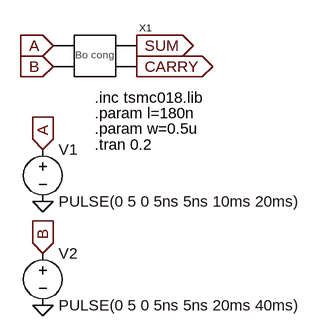
[diagram p0: schematic bocongsim.asc]
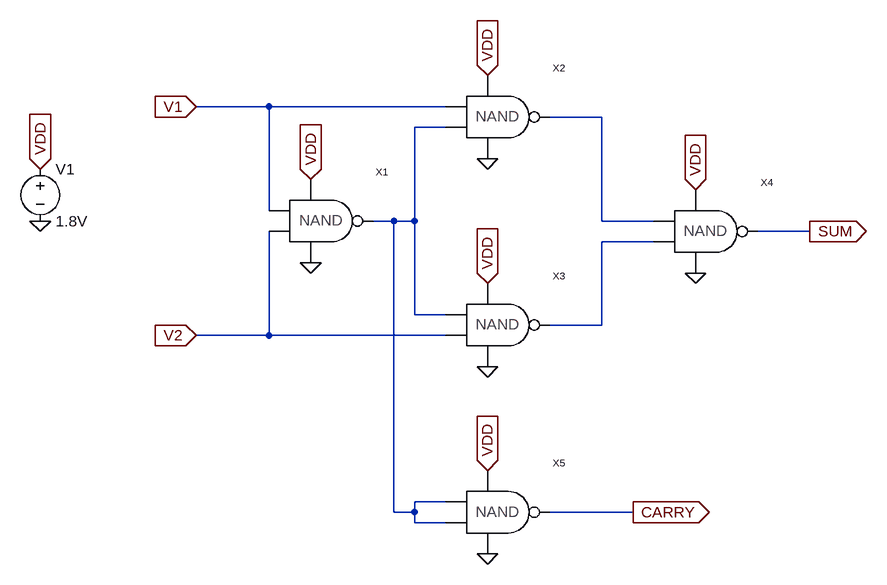
[diagram p1: sub-circuit bocong.asc]
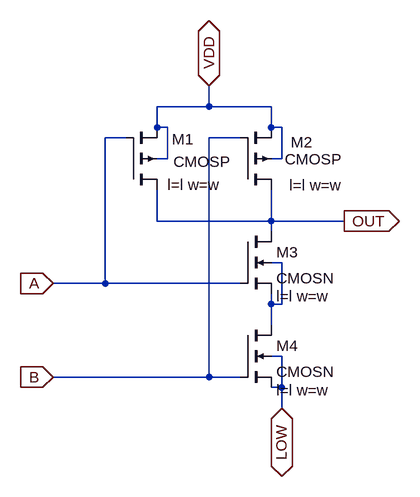
[diagram p2: sub-circuit nand.asc]
bocongsim.asc, the LTspice schematic file:
Version 4
SHEET 1 880 680
FLAG 256 112 SUM
IOPIN 256 112 Out
FLAG 256 144 CARRY
IOPIN 256 144 Out
FLAG 128 112 A
IOPIN 128 112 In
FLAG 128 144 B
IOPIN 128 144 In
FLAG 112 272 A
IOPIN 112 272 In
FLAG 112 432 B
IOPIN 112 432 In
FLAG 112 352 0
FLAG 112 512 0
SYMBOL bocong 288 304 R0
SYMATTR InstName X1
SYMBOL voltage 112 256 R0
WINDOW 123 0 0 Left 0
WINDOW 39 0 0 Left 0
SYMATTR InstName V1
SYMATTR Value PULSE(0 5 0 5ns 5ns 10ms 20ms)
SYMBOL voltage 112 416 R0
WINDOW 123 0 0 Left 0
WINDOW 39 0 0 Left 0
SYMATTR InstName V2
SYMATTR Value PULSE(0 5 0 5ns 5ns 20ms 40ms)
TEXT 192 192 Left 2 !.inc tsmc018.lib
TEXT 192 216 Left 2 !.param l=180n
TEXT 192 240 Left 2 !.param w=0.5u
TEXT 192 264 Left 2 !.tran 0.2

bocong.asc, the sub-circuit schematic file:
Version 4
SHEET 1 1080 692
WIRE 80 -16 -32 -16
WIRE 352 -16 80 -16
WIRE 592 0 512 0
WIRE 352 16 304 16
WIRE 80 144 80 -16
WIRE 272 160 240 160
WIRE 304 160 304 16
WIRE 304 160 272 160
WIRE 592 160 592 0
WIRE 672 160 592 160
WIRE 912 176 832 176
WIRE 672 192 592 192
WIRE 304 304 304 160
WIRE 352 304 304 304
WIRE 592 320 592 192
WIRE 592 320 512 320
WIRE 80 336 80 176
WIRE 80 336 -32 336
WIRE 352 336 80 336
WIRE 352 592 304 592
WIRE 272 608 272 160
WIRE 304 608 304 592
WIRE 304 608 272 608
WIRE 640 608 512 608
WIRE 304 624 304 608
WIRE 352 624 304 624
FLAG 416 384 0
FLAG 144 224 0
FLAG 736 240 0
FLAG 416 672 0
FLAG 416 64 0
FLAG 640 608 CARRY
IOPIN 640 608 Out
FLAG 912 176 SUM
IOPIN 912 176 Out
FLAG -32 -16 V1
IOPIN -32 -16 In
FLAG -32 336 V2
IOPIN -32 336 In
FLAG 416 -64 VDD
IOPIN 416 -64 In
FLAG 144 96 VDD
IOPIN 144 96 In
FLAG 416 256 VDD
IOPIN 416 256 In
FLAG 416 544 VDD
IOPIN 416 544 In
FLAG 736 112 VDD
IOPIN 736 112 In
FLAG -272 160 0
FLAG -272 80 VDD
IOPIN -272 80 In
SYMBOL NAND 160 256 R0
SYMATTR InstName X1
SYMBOL NAND 432 96 R0
SYMATTR InstName X2
SYMBOL NAND 432 416 R0
SYMATTR InstName X3
SYMBOL NAND 752 272 R0
SYMATTR InstName X4
SYMBOL NAND 432 704 R0
SYMATTR InstName X5
SYMBOL voltage -272 64 R0
WINDOW 123 0 0 Left 0
WINDOW 39 0 0 Left 0
SYMATTR InstName V1
SYMATTR Value 1.8V

nand.asc, the sub-circuit schematic file:
Version 4
SHEET 1 1024 680
WIRE 224 16 224 -16
WIRE 224 16 144 16
WIRE 320 16 224 16
WIRE 144 48 144 16
WIRE 160 48 144 48
WIRE 320 48 320 16
WIRE 336 48 320 48
WIRE 96 64 64 64
WIRE 272 64 224 64
WIRE 160 96 160 48
WIRE 160 96 144 96
WIRE 336 96 336 48
WIRE 336 96 320 96
WIRE 144 192 144 144
WIRE 320 192 320 144
WIRE 320 192 144 192
WIRE 432 192 320 192
WIRE 320 208 320 192
WIRE 336 256 320 256
WIRE 64 288 64 64
WIRE 64 288 -16 288
WIRE 272 288 64 288
WIRE 320 320 320 304
WIRE 336 320 336 256
WIRE 336 320 320 320
WIRE 320 352 320 320
WIRE 336 400 320 400
WIRE 224 432 224 64
WIRE 224 432 -16 432
WIRE 272 432 224 432
WIRE 336 448 336 400
WIRE 336 448 320 448
WIRE 336 480 336 448
FLAG 224 -16 VDD
IOPIN 224 -16 BiDir
FLAG 336 480 LOW
IOPIN 336 480 BiDir
FLAG 432 192 OUT
IOPIN 432 192 Out
FLAG -16 288 A
IOPIN -16 288 In
FLAG -16 432 B
IOPIN -16 432 In
SYMBOL nmos4 272 208 R0
WINDOW 123 56 100 Left 2
SYMATTR Value2 l=l w=w
SYMATTR InstName M3
SYMATTR Value CMOSN
SYMBOL nmos4 272 352 R0
WINDOW 123 56 100 Left 2
SYMATTR Value2 l=l w=w
SYMATTR InstName M4
SYMATTR Value CMOSN
SYMBOL pmos4 96 144 M180
WINDOW 123 64 8 Left 2
WINDOW 0 71 78 Left 2
WINDOW 3 73 43 Left 2
SYMATTR Value2 l=l w=w
SYMATTR InstName M1
SYMATTR Value CMOSP
SYMBOL pmos4 272 144 M180
WINDOW 123 76 7 Left 2
WINDOW 0 78 73 Left 2
WINDOW 3 69 47 Left 2
SYMATTR Value2 l=l w=w
SYMATTR InstName M2
SYMATTR Value CMOSP

The netlist it stands for:
* bocongsim.asc
XX1 A B SUM CARRY bocong
V1 A 0 PULSE(0 5 0 5ns 5ns 10ms 20ms)
V2 B 0 PULSE(0 5 0 5ns 5ns 20ms 40ms)

* block symbol definitions
.subckt bocong V1 V2 SUM CARRY
XX1 VDD 0 V1 V2 N002 nand
XX2 VDD 0 V1 N002 N001 nand
XX3 VDD 0 N002 V2 N003 nand
XX4 VDD 0 N001 N003 SUM nand
XX5 VDD 0 N002 N002 CARRY nand
V1 VDD 0 1.8V
.ends bocong

.subckt nand VDD LOW A B OUT
M3 OUT A N001 N001 CMOSN l=l w=w
M4 N001 B LOW LOW CMOSN l=l w=w
M1 OUT A VDD VDD CMOSP l=l w=w
M2 OUT B VDD VDD CMOSP l=l w=w
.ends nand

.model NMOS NMOS
.model PMOS PMOS
.lib standard.mos
.inc tsmc018.lib
.param l=180n
.param w=0.5u
.tran 0.2
.backanno
.end

* Results of the author's LTspice run, read from the files saved beside the schematic
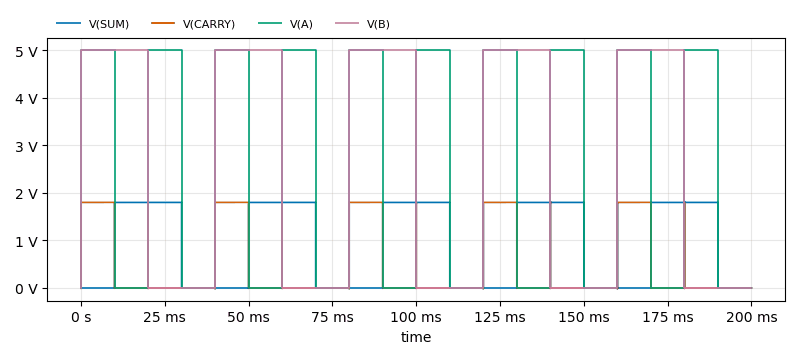
[diagram p3: Transient Analysis of bocongsim.asc, plotted from the saved traces]
* Transient Analysis, 1 run:
*   V(SUM): min -17.54 mV, max 1.819 V, average 900 mV, rms 1.273 V, last 0 V
*   V(CARRY): min -14.02 mV, max 1.807 V, average 450 mV, rms 900 mV, last 0 V
*   V(A): min 0 V, max 5 V, average 2.5 V, rms 3.536 V, last 0 V
*   V(B): min 0 V, max 5 V, average 2.5 V, rms 3.536 V, last 0 V